# EAGLE design Micro (EAGLE 7.3.0)
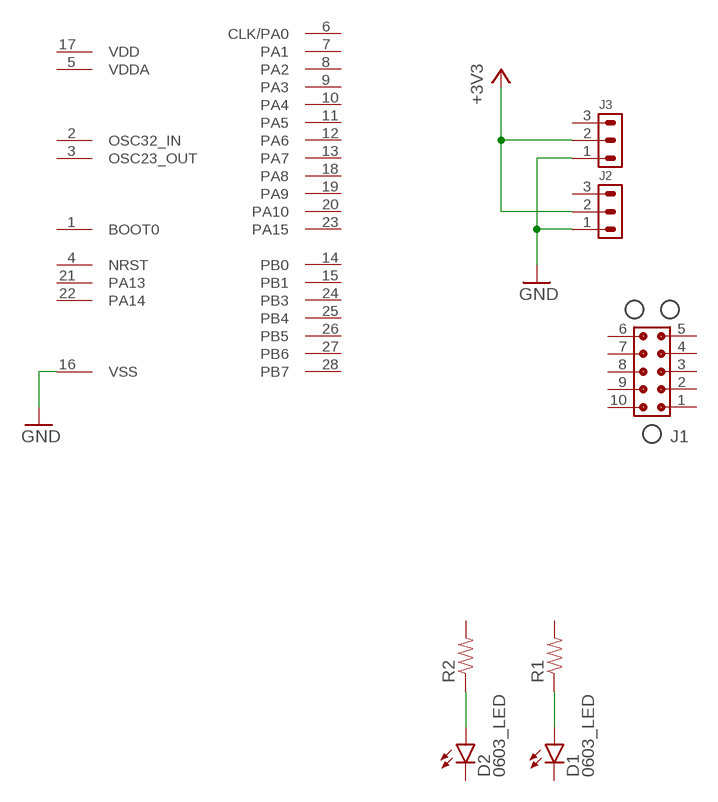
[diagram p0: schematic, sheet 1]

## Parts
D1  0603_LED  [0603_LED]
D2  0603_LED  [0603_LED]
J1  TC_2050_IDC_NL_TOP  [TC_2050_IDC_NL_TOP]
J2  CONN_3X1_LEAF_SMT_INV  [CONN_3X1_LEAF_SMT_INV]
J3  CONN_3X1_LEAF_SMT  [CONN_3X1_LEAF_SMT]
R1  0402_RES  [0402]
R2  0402_RES  [0402]
U1  STM32L031G6U6  [STM32_QFN_28_4X4]

## Nets
+3V3: J2.2 J3.2
GND: J2.1 J3.1 U1.16(VSS)
N$5: D1.P$1(A) R1.P$1
N$6: D2.P$1(A) R2.P$1
Unconnected: D1.P$2(C) D2.P$2(C) J1.1 J1.2 J1.3 J1.4 J1.5 J1.6 J1.7 J1.8 J1.9 J1.10 J2.3 J3.3 R1.P$2 R2.P$2 U1.1(BOOT0) U1.2(OSC32_IN) U1.3(OSC23_OUT) U1.4(NRST) U1.5(VDDA) U1.6(CLK/PA0) U1.7(PA1) U1.8(PA2) U1.9(PA3) U1.10(PA4) U1.11(PA5) U1.12(PA6) U1.13(PA7) U1.14(PB0) U1.15(PB1) U1.17(VDD) U1.18(PA8) U1.19(PA9) U1.20(PA10) U1.21(PA13) U1.22(PA14) U1.23(PA15) U1.24(PB3) U1.25(PB4) U1.26(PB5) U1.27(PB6) U1.28(PB7)

## Library data of the parts
D1 D2 = stepOSP:0603_LED
J1 = leaf:TC_2050_IDC_NL_TOP
J2 = leaf:CONN_3X1_LEAF_SMT_INV
J3 = leaf:CONN_3X1_LEAF_SMT
R1 R2 = stepOSP:0402_RES
U1 = leaf:STM32L031G6U6

## Board
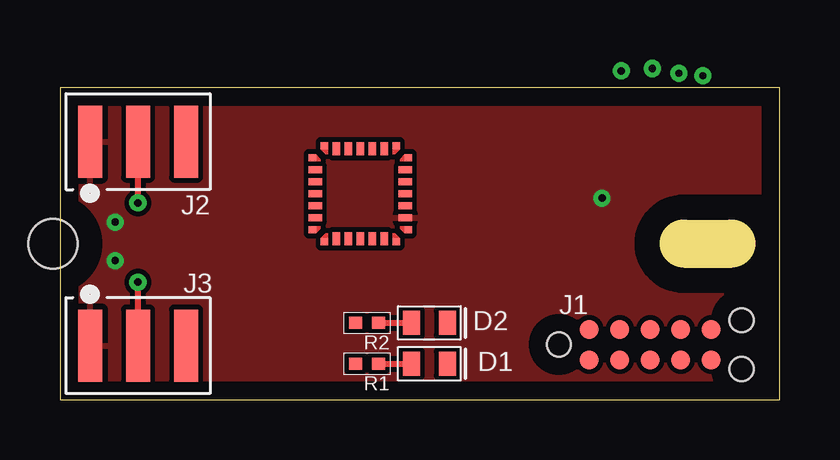
[diagram p1: board, top side]
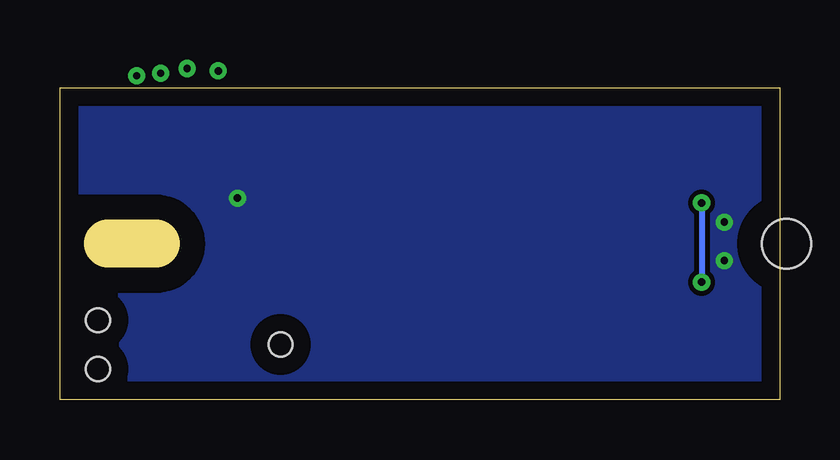
[diagram p2: board, bottom side, seen from below]

Size 30 x 13 mm. Coordinates in mm from the lower left corner, seen from the top.
Outline: 0,0 30,0 30,13 0,13 0,0
Copper layers (1*16): Top 0.035mm / dielectric 1.5mm / Bottom 0.035mm
Design rules "default *": minimum track width 10mil, minimum drill 24mil, track to track 8mil, track to pad 8mil, pad to pad 8mil, via to via 8mil, smd to smd 8mil, copper to edge 30mil, drill to drill 8mil, minimum pad ring 10mil, minimum via ring 8mil, stop-mask expansion 4mil, vias tented up to drill 12mil, thermal gap 10mil
Holes 2.05 mm at -0.3,6.5
tRestrict: area -2.3,4.5 to 1.7,8.6; 3 lines
bRestrict: area -2.3,4.5 to 1.7,8.6; 3 lines
Milling: 1 lines

### Footprints (pad centres in the part's own frame; a part is rotated, then mirrored left to right if it is on the bottom)
0603_LED = smd 0.7 x 1: P$1 -0.75,0; P$2 0.75,0
TC_2050_IDC_NL_TOP = smd 0.787 x 0.787: 1 1.27,-0.635; 2 2.54,-0.635; 3 3.81,-0.635; 4 5.08,-0.635; 5 6.35,-0.635; 6 6.35,0.635; 7 5.08,0.635; 8 3.81,0.635; 9 2.54,0.635; 10 1.27,0.635 | hole 0.991: 0,0; 7.62,1.016; 7.62,-1.016
CONN_3X1_LEAF_SMT_INV = smd 1 x 3: 1 -2,0; 2 0,0; 3 2,0
CONN_3X1_LEAF_SMT = smd 1 x 3: 1 2,0; 2 0,0; 3 -2,0
0402 = smd 0.55 x 0.5: P$1 -0.475,0; P$2 0.475,0
STM32_QFN_28_4X4 = smd 0.3 x 0.3: 1 -2,1.5; 7 -2,-1.5; 8 -1.5,-2; 14 1.5,-2; 15 2,-1.5; 21 2,1.5; 22 1.5,2; 28 -1.5,2 | smd 0.55 x 0.3: 2 -1.875,1; 3 -1.875,0.5; 4 -1.875,0; 5 -1.875,-0.5; 6 -1.875,-1; 16 1.875,-1; 17 1.875,-0.5; 18 1.875,0; 19 1.875,0.5; 20 1.875,1 | smd 0.3 x 0.55: 9 -1,-1.875; 10 -0.5,-1.875; 11 0,-1.875; 12 0.5,-1.875; 13 1,-1.875; 23 1,1.875; 24 0.5,1.875; 25 0,1.875; 26 -0.5,1.875; 27 -1,1.875

### Placement (x,y rotation side)
D1  15.4,1.5 0 top
D2  15.4,3.2 0 top
J1  20.8,2.3 0 top
J2  3.25,10.75 0 top
J3  3.25,2.25 180 top
R1  12.8,1.5 180 top
R2  12.8,3.2 180 top
U1  12.52,8.58 0 top

### Tracks (layer width: path | path; a pad name or v marks a point on that pad's centre or on a via)
+3V3  (via drill 0.3)
  Top 0.254: J3.2 v3.25,4.9 | v3.25,8.2 J2.2
  Bottom 0.254: v3.25,8.2 v3.25,4.9
GND  (via drill 0.3)
  other vias: 2.3,7.4 2.3,5.8 22.6,8.4
  pour Top: 0,13 30,13 30,0 0,0
  pour Bottom: 0,0 30,0 30,13 0,13
N$1  (via drill 0.3)
  other vias: 26.8,13.5
N$2  (via drill 0.3)
  other vias: 25.8,13.6
N$3  (via drill 0.3)
  other vias: 24.7,13.8
N$4  (via drill 0.3)
  other vias: 23.4,13.7
N$5
  Top 0.254: R1.P$1 D1.P$1
N$6
  Top 0.254: R2.P$1 D2.P$1